# EAGLE design node (EAGLE 9.6.2)
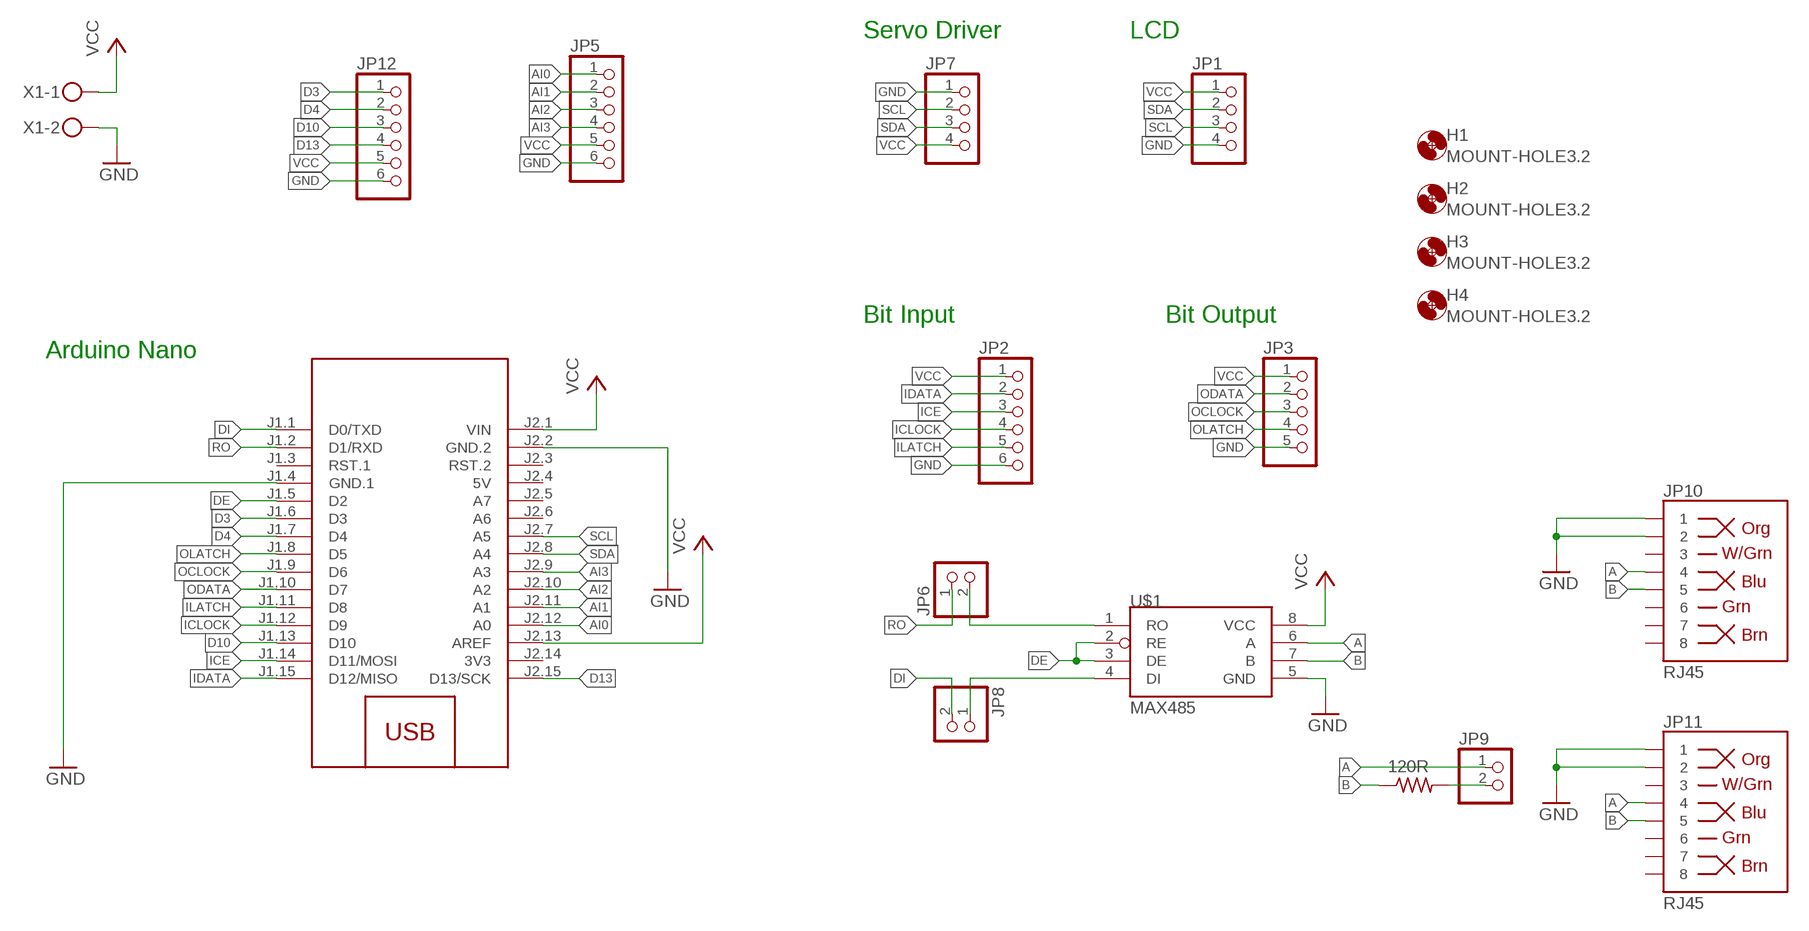
[diagram p0: schematic, sheet 1]

## Parts
H1  MOUNT-HOLE3.2  [3,2]
H2  MOUNT-HOLE3.2  [3,2]
H3  MOUNT-HOLE3.2  [3,2]
H4  MOUNT-HOLE3.2  [3,2]
JP1  PINHD-1X4/90  [1X04/90]
JP2  PINHD-1X6/90  [1X06/90]
JP3  PINHD-1X5/90  [1X05/90]
JP5  PINHD-1X6  [1X06]
JP6  PINHD-1X2  [1X02]
JP7  PINHD-1X4/90  [1X04/90]
JP8  PINHD-1X2  [1X02]
JP9  PINHD-1X2  [1X02]
JP10  RJ45  RJ45-8PTH  [RJ45-8]
JP11  RJ45  RJ45-8PTH  [RJ45-8]
JP12  PINHD-1X6  [1X06]
M1  ARDUINO-NANO-3.0  [ARDUINO-NANO-3.0]
R2  120R  R-US_0207/2V  [0207/2V]
U$1  MAX485  MAX485DIL  [DIL08]
X1  MKDSN1,5/2-5,08  [MKDSN1,5/2-5,08]

## Nets
A: JP9.1 JP10.4 JP11.4 U$1.6(A)
AI0: JP5.1 M1.J2.12(A0)
AI1: JP5.2 M1.J2.11(A1)
AI2: JP5.3 M1.J2.10(A2)
AI3: JP5.4 M1.J2.9(A3)
B: JP10.5 JP11.5 R2.1 U$1.7(B)
D3: JP12.1 M1.J1.6(D3)
D4: JP12.2 M1.J1.7(D4)
D10: JP12.3 M1.J1.13(D10)
D13: JP12.4 M1.J2.15(D13/SCK)
DE: M1.J1.5(D2) U$1.2(RE) U$1.3(DE)
DI: JP8.2 M1.J1.1(D0/TXD)
GND: JP1.4 JP2.6 JP3.5 JP5.6 JP7.1 JP10.1 JP10.2 JP11.1 JP11.2 JP12.6 M1.J1.4(GND.1) M1.J2.2(GND.2) U$1.5(GND) X1.2
ICE: JP2.3 M1.J1.14(D11/MOSI)
ICLOCK: JP2.4 M1.J1.12(D9)
IDATA: JP2.2 M1.J1.15(D12/MISO)
ILATCH: JP2.5 M1.J1.11(D8)
N$1: JP9.2 R2.2
N$6: JP6.2 U$1.1(RO)
N$10: JP8.1 U$1.4(DI)
OCLOCK: JP3.3 M1.J1.9(D6)
ODATA: JP3.2 M1.J1.10(D7)
OLATCH: JP3.4 M1.J1.8(D5)
RO: JP6.1 M1.J1.2(D1/RXD)
SCL: JP1.3 JP7.2 M1.J2.7(A5)
SDA: JP1.2 JP7.3 M1.J2.8(A4)
VCC [power]: JP1.1 JP2.1 JP3.1 JP5.5 JP7.4 JP12.5 M1.J2.1(VIN) M1.J2.13(AREF) U$1.8(VCC) X1.1
Unconnected: JP10.3 JP10.6 JP10.7 JP10.8 JP11.3 JP11.6 JP11.7 JP11.8 M1.J1.3(RST.1) M1.J2.3(RST.2) M1.J2.5(A7) M1.J2.6(A6)

## Notes on the sheet
- Servo Driver | LCD
- Bit Input | Bit Output
- Arduino Nano

## Power pins joined to a net without a drawn wire
3V3: M1.J2.14(3V3)
5V: M1.J2.4(5V)

## Library data of the parts
H1-H4 = holes:MOUNT-HOLE: MOUNTING HOLE with drill center marker
JP1 JP7 = pinhead:PINHD-1X4: PIN HEADER
JP2 JP5 JP12 = pinhead:PINHD-1X6: PIN HEADER
JP3 = pinhead:PINHD-1X5: PIN HEADER
JP6 JP8 JP9 = pinhead:PINHD-1X2: PIN HEADER
JP10 JP11 = SparkFun-Connectors:RJ45-8: RJ45 Jack Simple RJ45, 8-pin connection - connector for common Cat5, Cat5e, and Cat6 Ethernet cables. Footprint not yet proven in production. Connector sku is PRT-00643; Breakout PCB sku is BOB-00716.; PROD_ID: CONN-08506
M1 = diy-modules:ARDUINO-NANO-3.0: Arduino Nano 3.0
R2 = resistor:R-US_: RESISTOR, American symbol
U$1 = SparkFun-DigitalIC:MAX485: RS-485 transceiver
X1 = con-phoenix-508:MKDSN1,5/2-5,08: MKDSN 1,5/ 2-5,08 Printklemme Nennstrom: 13,5 A Nennspannung: 250 V Rastermaß: 5,08 mm Polzahl: 2 Anschlussart: Schraubanschluss Montage: Löten Anschlussrichtung Leiter/Platine: 0 ° Artikelnummer: 1729128 Source: http://eshop.phoenixcontact.com .. 1729128.pdf

## Net classes
1 power: width 0.025 mm

## Board
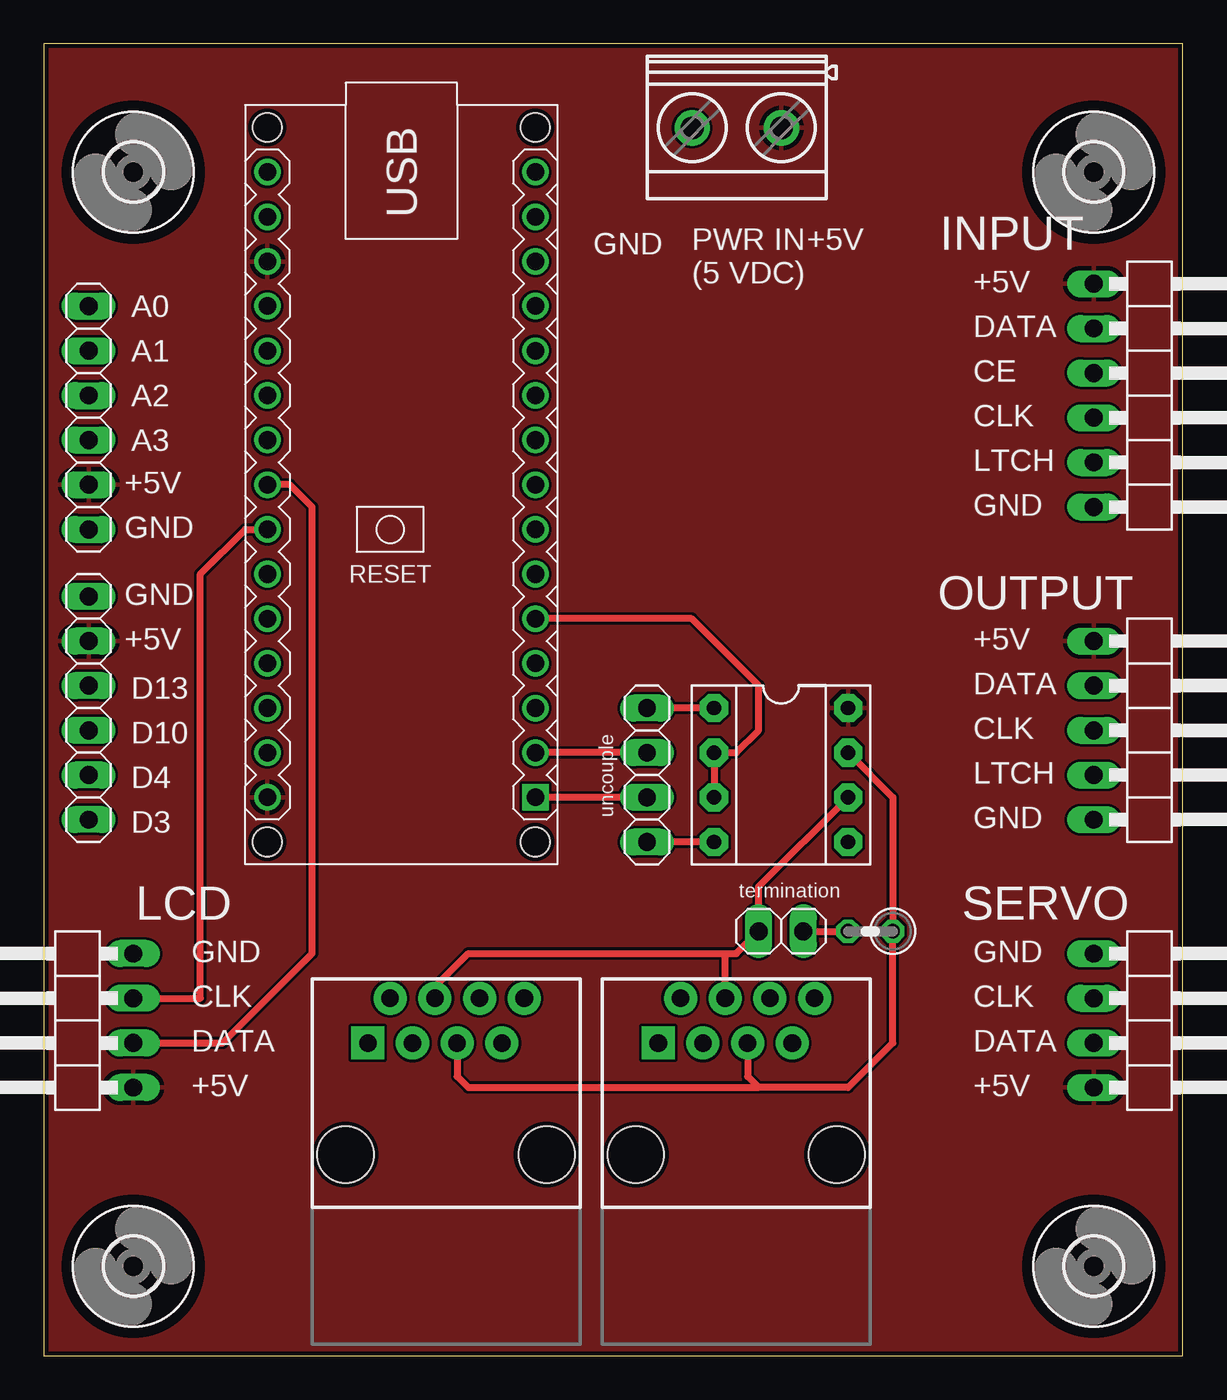
[diagram p1: board, top side]
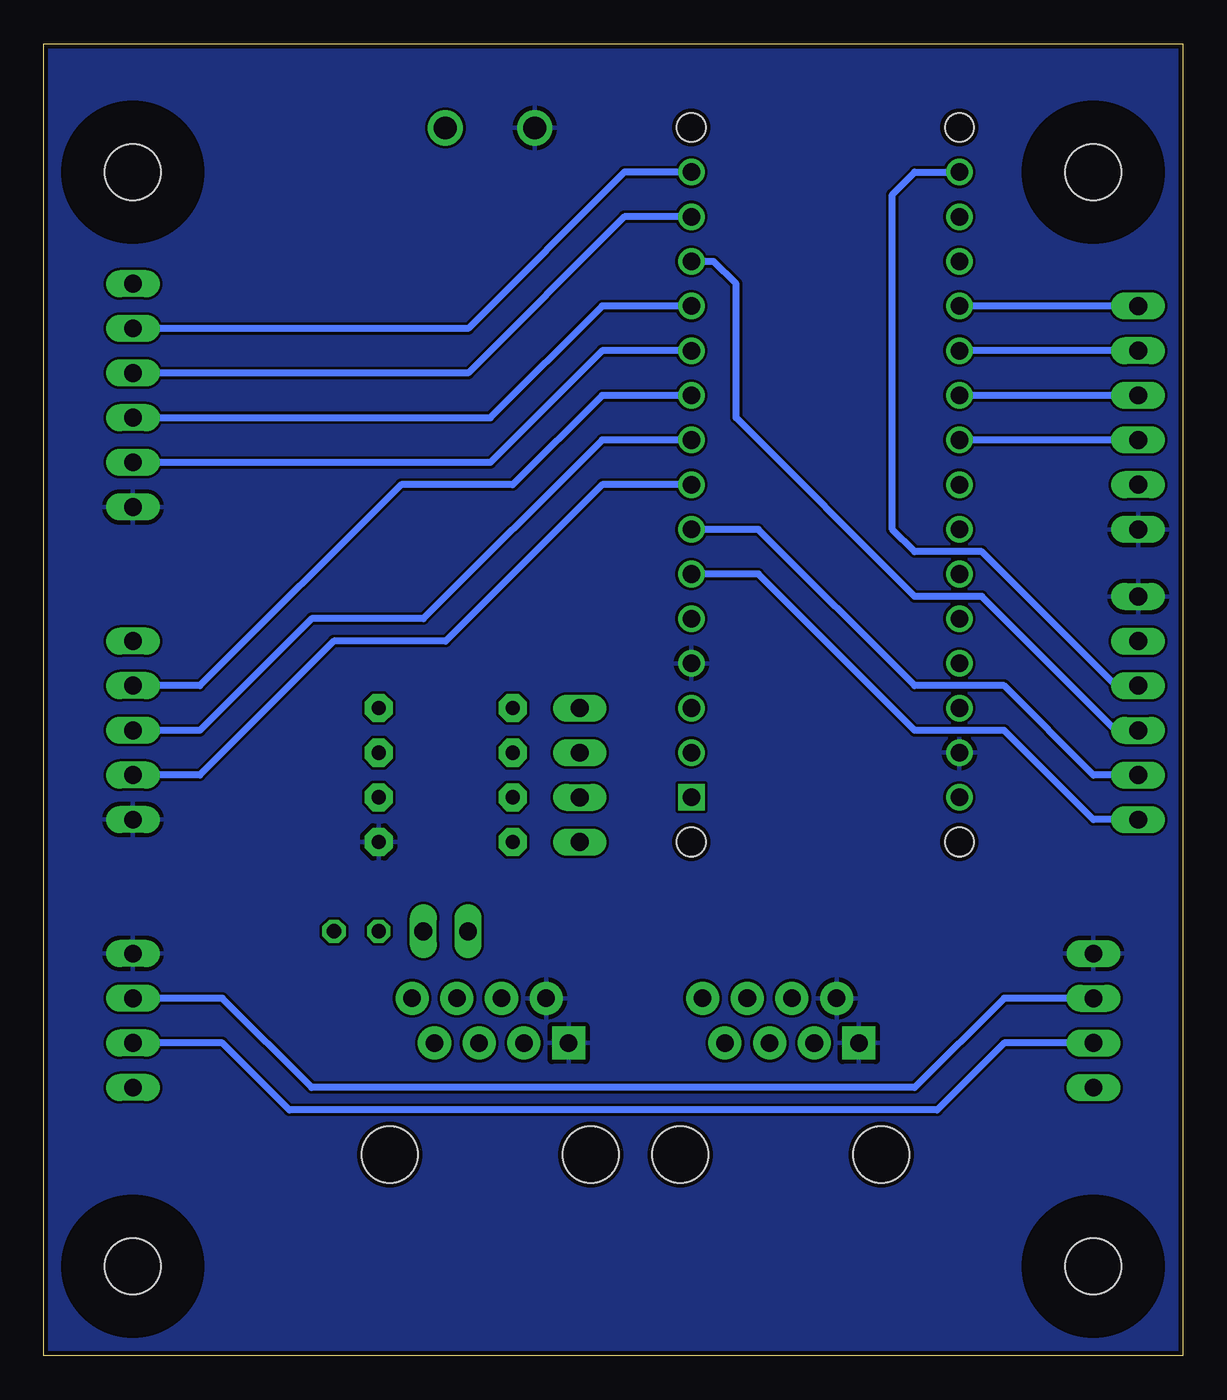
[diagram p2: board, bottom side, seen from below]

Size 64.75 x 74.6 mm. Coordinates in mm from the lower left corner, seen from the top.
Outline: 0,0 64.75,0 64.75,74.6 0,74.6 0,0
Copper layers (1*16): Top 0.035mm / dielectric 1.5mm / Bottom 0.035mm
Design rules "SeeedStudio_2layer": minimum track width 6mil, minimum drill 12mil, track to track 6mil, track to pad 6mil, pad to pad 6mil, via to via 6mil, smd to smd 0mil, copper to edge 10mil, drill to drill 10mil, minimum pad ring 10mil, minimum via ring 6mil, stop-mask expansion 2mil, vias tented up to drill 100mil, thermal gap 10mil

### Footprints (pad centres in the part's own frame; a part is rotated, then mirrored left to right if it is on the bottom)
3,2 = hole 3.2: 0,0
1X04/90 = drill 1.016 long: 1 -3.81,-3.81; 2 -1.27,-3.81; 3 1.27,-3.81; 4 3.81,-3.81
1X06/90 = drill 1.016 long: 1 -6.35,-3.81; 2 -3.81,-3.81; 3 -1.27,-3.81; 4 1.27,-3.81; 5 3.81,-3.81; 6 6.35,-3.81
1X05/90 = drill 1.016 long: 1 -5.08,-3.81; 2 -2.54,-3.81; 3 0,-3.81; 4 2.54,-3.81; 5 5.08,-3.81
1X06 = drill 1.016 long: 1 -6.35,0; 2 -3.81,0; 3 -1.27,0; 4 1.27,0; 5 3.81,0; 6 6.35,0
1X02 = drill 1.016 long: 1 -1.27,0; 2 1.27,0
RJ45-8 = drill 1 pad 1.88 square: 1 -4.445,6.35 | drill 1 pad 1.88: 2 -3.175,8.89; 3 -1.905,6.35; 4 -0.635,8.89; 5 0.635,6.35; 6 1.905,8.89; 7 3.175,6.35; 8 4.445,8.89 | hole 3.2: -5.715,0; 5.715,0
ARDUINO-NANO-3.0 = drill 1 square: J1.1 17.78,7.62 | drill 1: J1.2 15.24,7.62; J1.3 12.7,7.62; J1.4 10.16,7.62; J1.5 7.62,7.62; J1.6 5.08,7.62; J1.7 2.54,7.62; J1.8 0,7.62; J1.9 -2.54,7.62; J1.10 -5.08,7.62; J1.11 -7.62,7.62; J1.12 -10.16,7.62; J1.13 -12.7,7.62; J1.14 -15.24,7.62; J1.15 -17.78,7.62; J2.1 17.78,-7.62; J2.2 15.24,-7.62; J2.3 12.7,-7.62; J2.4 10.16,-7.62; J2.5 7.62,-7.62; J2.6 5.08,-7.62; J2.7 2.54,-7.62; J2.8 0,-7.62; J2.9 -2.54,-7.62; J2.10 -5.08,-7.62; J2.11 -7.62,-7.62; J2.12 -10.16,-7.62; J2.13 -12.7,-7.62; J2.14 -15.24,-7.62; J2.15 -17.78,-7.62 | hole 1.651: -20.32,7.62; -20.32,-7.62; 20.32,-7.62; 20.32,7.62
0207/2V = drill 0.813 octagon: 1 -1.27,0; 2 1.27,0
DIL08 = drill 0.813 pad 1.6 octagon: 1 -3.81,-3.81; 2 -1.27,-3.81; 3 1.27,-3.81; 4 3.81,-3.81; 5 3.81,3.81; 6 1.27,3.81; 7 -1.27,3.81; 8 -3.81,3.81
MKDSN1,5/2-5,08 = drill 1.3 pad 2: 1 -2.561,0.025; 2 2.519,0.025

### Placement (x,y rotation side)
H1  5.08,5.08 0 top
H2  5.08,67.31 0 top
H3  59.69,5.08 0 top
H4  59.69,67.31 0 top
JP1  1.27,19.05 90 top
JP2  63.5,54.61 270 top
JP3  63.5,35.56 270 top
JP5  2.54,53.34 270 top
JP6  34.29,35.56 90 top
JP7  63.5,19.05 270 top
JP8  34.29,30.48 90 top
JP9  41.91,24.13 0 top
JP10  39.37,11.43 0 top
JP11  22.86,11.43 0 top
JP12  2.54,36.83 90 top
M1  20.32,49.53 270 top
R2  46.99,24.13 180 top
U$1  41.91,33.02 270 top
X1  39.37,69.85 180 top

### Tracks (layer width: path | path; a pad name or v marks a point on that pad's centre or on a via)
A
  Top 0.406: JP11.4 22.23,20.95 24.13,22.86 38.86,22.86 | 38.86,22.86 39.37,22.86 JP9.1 40.64,26.67 U$1.6 | JP10.4 38.73,22.73 38.86,22.86
AI0
  Bottom 0.406: JP5.1 M1.J2.12
AI1
  Bottom 0.406: JP5.2 M1.J2.11
AI2
  Bottom 0.406: JP5.3 M1.J2.10
AI3
  Bottom 0.406: JP5.4 M1.J2.9
B
  Top 0.406: JP11.5 23.5,15.88 24.13,15.24 40.64,15.24 | 40.64,15.24 45.72,15.24 48.26,17.78 R2.1 48.26,31.75 U$1.7 | JP10.5 40.01,15.88 40.64,15.24
D3
  Bottom 0.406: JP12.1 5.08,30.48 10.16,35.56 15.24,35.56 24.13,44.45 M1.J1.6
D4
  Bottom 0.406: JP12.2 5.08,33.02 10.16,38.1 15.24,38.1 24.13,46.99 M1.J1.7
D10
  Bottom 0.406: JP12.3 3.81,35.56 11.43,43.18 15.24,43.18 25.4,53.34 25.4,60.96 26.67,62.23 M1.J1.13
D13
  Bottom 0.406: JP12.4 3.81,38.1 11.43,45.72 15.24,45.72 16.51,46.99 16.51,66.04 15.24,67.31 M1.J2.15
DE
  Top 0.406: U$1.3 U$1.2 39.37,34.29 40.64,35.56 40.64,38.1 36.83,41.91 M1.J1.5
DI
  Top 0.406: JP8.2 M1.J1.1
GND
  pour Bottom: -5.08,76.2 95.25,76.2 95.25,-1.27 -5.08,-1.27
ICE
  Bottom 0.406: M1.J1.14 31.75,64.77 40.64,55.88 JP2.3
ICLOCK
  Bottom 0.406: M1.J1.12 33.02,59.69 39.37,53.34 JP2.4
IDATA
  Bottom 0.406: M1.J1.15 31.75,67.31 40.64,58.42 JP2.2
ILATCH
  Bottom 0.406: M1.J1.11 33.02,57.15 39.37,50.8 JP2.5
N$1
  Top 0.406: JP9.2 R2.2
N$6
  Top 0.406: U$1.1 JP6.2
N$10
  Top 0.406: U$1.4 JP8.1
OCLOCK
  Bottom 0.406: JP3.3 55.88,35.56 49.53,41.91 43.18,41.91 33.02,52.07 M1.J1.9
ODATA
  Bottom 0.406: JP3.2 55.88,38.1 44.45,49.53 38.1,49.53 33.02,54.61 M1.J1.10
OLATCH
  Bottom 0.406: M1.J1.8 33.02,49.53 41.91,40.64 48.26,40.64 55.88,33.02 JP3.4
RO
  Top 0.406: JP6.1 M1.J1.2
SCL
  Top 0.406: JP1.3 8.89,20.32 8.89,44.45 11.43,46.99 M1.J2.7
  Bottom 0.406: JP1.3 10.16,20.32 15.24,15.24 49.53,15.24 54.61,20.32 JP7.2
SDA
  Top 0.406: JP1.2 10.16,17.78 15.24,22.86 15.24,48.26 13.97,49.53 M1.J2.8
  Bottom 0.406: JP1.2 10.16,17.78 13.97,13.97 50.8,13.97 54.61,17.78 JP7.3
VCC
  pour Top: -2.54,-2.54 -2.54,77.47 97.79,77.47 97.79,-2.54

### Text on the board
tNames: GND | +5V | INPUT | PWR IN / (5 VDC) | +5V | A0 | DATA | A1 | CE | A2 | CLK | A3 | LTCH | +5V | GND | GND | GND | OUTPUT | +5V | +5V | DATA | D13 | D10 | CLK | LTCH | D4 | uncouple | D3 | GND | termination | LCD | SERVO | GND | GND | CLK | CLK | DATA | DATA | +5V | +5V
tValues: Node 08/29/20